# Altium project tinyFan.PrjPCB
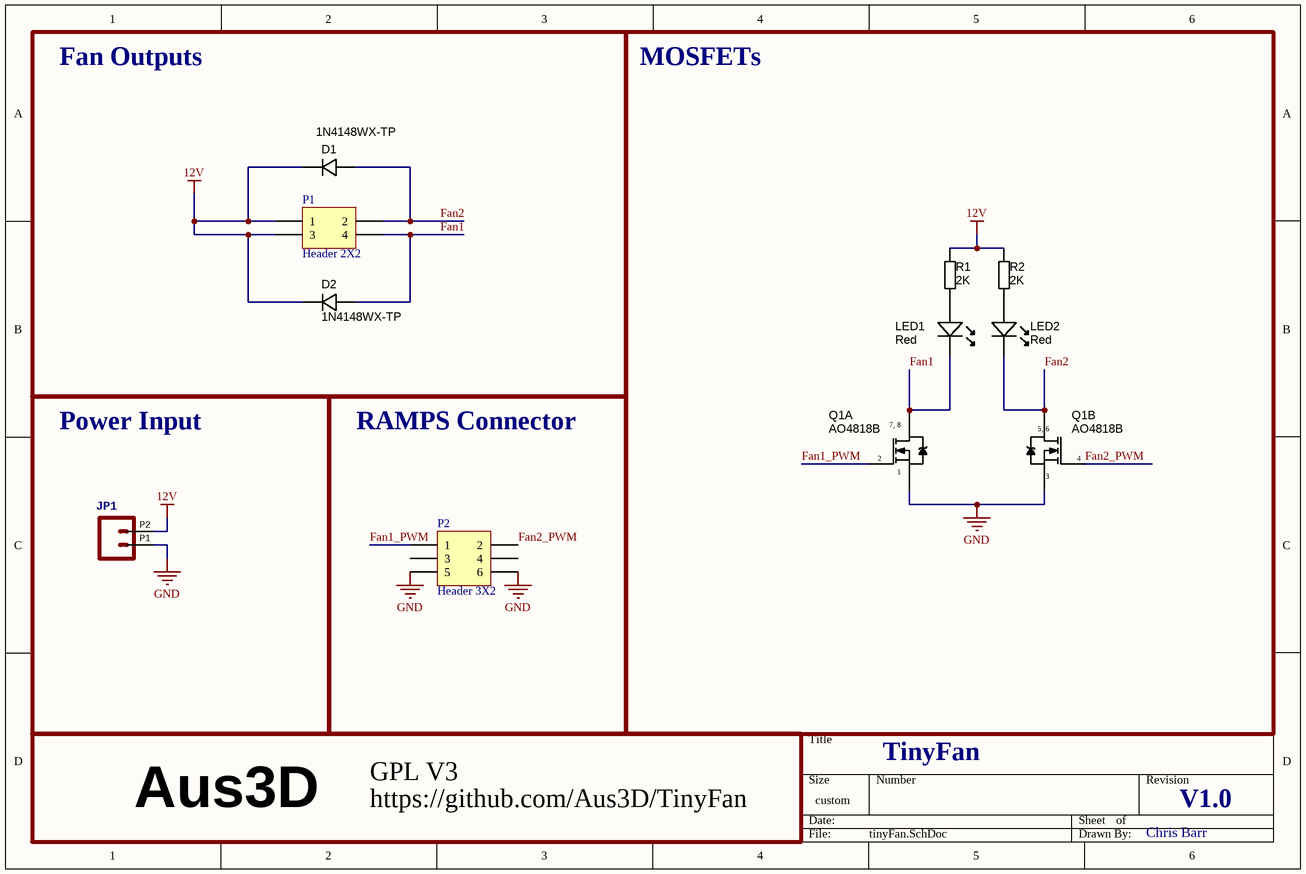
[diagram p0: tinyFan.SchDoc]
1 sheet, 10 parts. Net scope: global (net labels, ports and power ports of the same name join across sheets).
Board file: tinyFan.PcbDoc

## Sheet tinyFan.SchDoc
size 243 x 162 mm; Author: Chris; CompanyName: Aus3D; DrawnBy: Chris; Engineer: Chris; PageSetup: Record=PageOptions|CenterHorizontal=True|CenterVertical=True|PrintScale=1.13|XCorrection=1.00|YCorrection=1.00|PrintKind=0|BorderSize=5000000|LeftOffset=0|BottomOffset=0|Orientation=2|PaperLength=1000|PaperWidth=1000|Scale=100|PaperSource=7|PrintQuality=-3|MediaType=1|DitherType=10|PrintScaleMode=1|PaperKind=Letter|PaperIndex=1; CurrentDate: 29-8-2015

### Parts
D1  Manufacturer Part Number: 1N4148WX-TP  [SOD323]  (hidden comment: DIODE_75V_500mW)
D2  Manufacturer Part Number: 1N4148WX-TP  [SOD323]  (hidden comment: DIODE_75V_500mW)
JP1  Standard 2-pin 0.1" header. Use with  - straight break away headers ( PRT-00116) - right angle break away headers (PRT-00553) - swiss pins (PRT-00743) - machine pins (PRT-00117) - female headers (PRT-00115)   Molex polarized connector foot print use with: PRT-08233 with associated crimp pins and housings.  2.54_SCREWTERM for use with  PRT-10571.  3.5mm Screw Terminal footprints for  PRT-08084  5mm Screw Terminal footprints for use with PRT-08432  [1X02_2.54_SCREWTERM]  (value not drawn)
LED1  Red  [LED-0603-RED]
LED2  Red  [LED-0603-RED]
P1  Header 2X2  [Header-2x2-male]
P2  Header 3X2  [Header-3x2-female]
Q1  Manufacturer Part Number 1: AO4818B  [SOIC127P600X175-8AN]  (hidden comment: MOSFET_AO4818B)  (parts A,B of 2)
R1  value 2K  [RESC1608X55N]  (hidden comment: Thick Film)
R2  value 2K  [RESC1608X55N]  (hidden comment: Thick Film)

### Blocks framed on the sheet
Fan Outputs: D1 D2 P1
MOSFETs: LED1 LED2 Q1 R1 R2
Power Input: JP1
RAMPS Connector: P2

### Nets
12V: D1.K D2.K JP1.P2 P1.1 P1.3 R1.1 R2.1
GND: JP1.P1 P2.5 P2.6 Q1.1(S) Q1.3(S)
Fan1: D2.A LED1.K P1.4 Q1.7(D) Q1.8(D)
Fan1_PWM: P2.1 Q1.2(G)
Fan2: D1.A LED2.K P1.2 Q1.5(D) Q1.6(D)
Fan2_PWM: P2.2 Q1.4(G)
NetLED1_A: LED1.A R1.2
NetLED2_A: LED2.A R2.2

Not connected (* = marked no-connect by the designer): P2 3 4

### Notes on the sheet
- TinyFan
- Aus3D
- https://github.com/Aus3D/TinyFan
- GPL V3
- V1.0
- Chris Barr
- (in symbol MOSFET_AO4818B, part A) 7, 8
- (in symbol MOSFET_AO4818B, part B) 5, 6

### Library data of the parts
D1 D2 = DIODE_75V_500mW: Diode SMD 300mA 0.5W SOD323; Manufacturer: Micro Commercial Co; Ratings: 75V; 300mA; 0.5W; Material: Si; Diode Type: Standard; Value: Vf=1V @ 50mA; SCDType: source; Package / Case: SOD323; Supplier 1: Digi-Key; Supplier Part Number 1: 1N4148WXTPMSCT-ND
JP1 = M022.54MM_SCREWTERM
LED1 LED2 = LED_SMD_Red_0603_220mcd: LED 0603 SMD Hyper Red 630nm 220mcd 20mA; Manufacturer 1: Kingbright Company LLC; Manufacturer Part Number 1: APT1608SURCK; Material: AlGaInP on GaAs; Ratings: 220 mcd; 630 nm; Voltage - Forward (Vf) Typ: 1.95V; Voltage - Forward (Vf) @ 10mA: 1.9V; SCDType: source; Package / Case: 0603 (1608 metric); Supplier 1: Digi-Key; Supplier Part Number 1: 754-1123-1-ND; ComponentLink1URL: http://www.us.kingbright.com/images/catalog/SPEC/APT1608SURCK.pdf; ComponentLink1Description: http://www.us.kingbright.com/images/catalog/SPEC/APT1608SURCK.pdf
P1 = Header 2X2: Header, 2-Pin, Dual row; LatestRevisionDate: 17-Jul-2002; LatestRevisionNote: Re-released for DXP Platform.; Publisher: Altium Limited
P2 = Header 3X2: Header, 3-Pin, Dual row; LatestRevisionDate: 17-Jul-2002; LatestRevisionNote: Re-released for DXP Platform.; Publisher: Altium Limited
Q1 = MOSFET_AO4818B: MOSFET Dual-Channel 30V 8.5A SOIC-8 SMD; Manufacturer 1: Alpha & Omega Semiconductor Inc; Ratings: 2W; 30V; 8.5A; 16 mOhm; Material: Silicon; SCDType: source; Package / Case: SOIC-8; Supplier 1: Digi-Key; Supplier Part Number 1: 785-1059-1-ND
R1 R2 = RES_330R_0603_5%: Resistor SMD chip 330 Ohm 0.1W 5% 0603; Manufacturer 1: Vishay Dale; Manufacturer Part Number 1: CRCW0603330RJNEA; Ratings: 1/10 W; SCDType: spec; Manufacturer 2: Yageo; Manufacturer Part Number 2: RC0603JR-07330RL; Package / Case: 0603 (1608 metric); Tolerance: ±5%; Material: Thick Film; Supplier 1: Digi-Key; Supplier Part Number 1: 541-330GCT-ND; ComponentLink1URL: http://www.vishay.com/doc?20035; ComponentLink1Description: http://www.vishay.com/doc?20035; Supplier 2: Digi-Key; Supplier Part Number 2: 311-330GRCT-ND; ComponentLink2URL: http://www.yageo.com/documents/recent/PYu-RC0603_51_RoHS_L_4.pdf; ComponentLink2Description: http://www.yageo.com/documents/recent/PYu-RC0603_51_RoHS_L_4.pdf; Supplier: http://au.rs-online.com/web/p/surface-mount-fixed-resistors/6790226/